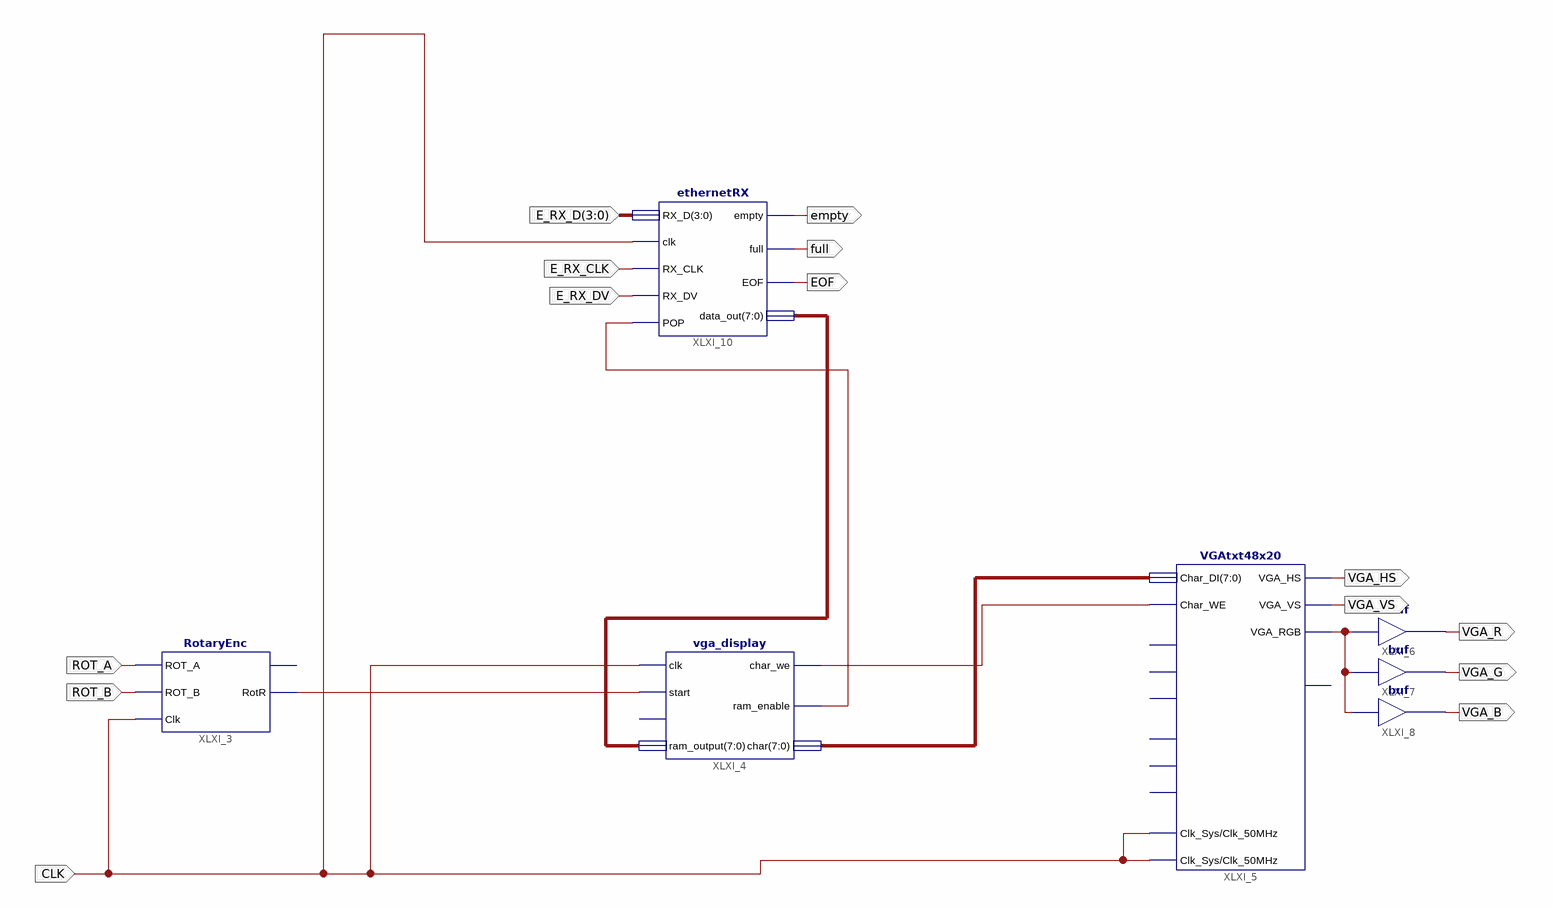
[diagram p0: schematic sheet 1]
// Xilinx ISE schematic new_schem.sch (spartan3e) as structural Verilog: 7 symbols, 14 ports
module new_schem (
  input  ROT_A,
  input  ROT_B,
  input  CLK,
  input  [3:0] E_RX_D,
  input  E_RX_CLK,
  input  E_RX_DV,
  output VGA_R,
  output VGA_G,
  output VGA_B,
  output VGA_VS,
  output VGA_HS,
  output EOF,
  output full,
  output empty
);

  wire XLXN_13, XLXN_15, XLXN_18, XLXN_26;
  wire [7:0] XLXN_16, XLXN_27;

  RotaryEnc XLXI_3 (.ROT_A(ROT_A), .ROT_B(ROT_B), .RotR(XLXN_13), .Clk(CLK));  // open: RotL
  vga_display XLXI_4 (
    .clk(CLK), .start(XLXN_13), .ram_output(XLXN_27), .char_we(XLXN_15), .ram_enable(XLXN_26), .char(XLXN_16));  // open: reset
  VGAtxt48x20 XLXI_5 (
    .Char_DI(XLXN_16), .Clk_Sys(CLK), .Clk_50MHz(CLK), .VGA_HS(VGA_HS), .VGA_VS(VGA_VS), .VGA_RGB(XLXN_18),
    .Char_WE(XLXN_15));  // open: Home, NewLine, Goto00, CursorOn, ScrollEn, ScrollClear, Busy
  buf XLXI_6 (VGA_R, XLXN_18);
  buf XLXI_7 (VGA_G, XLXN_18);
  buf XLXI_8 (VGA_B, XLXN_18);
  ethernetRX XLXI_10 (
    .RX_D(E_RX_D), .clk(CLK), .RX_CLK(E_RX_CLK), .RX_DV(E_RX_DV), .POP(XLXN_26), .empty(empty), .full(full),
    .EOF(EOF), .data_out(XLXN_27));
endmodule
